# Altium schematic sheet SHDN-S05-V00-Microcontroller.SchDoc: Microcontroller
size A3; DrawnBy: Zoe Goodward; DocumentNumber: 2; Revision: 01; SheetNumber: 2; SheetTotal: 10; Version: 01; Project: Shutdown Board 2020; PageSetup: Record=PageOptions|CenterHorizontal=True|CenterVertical=True|PrintScale=0.97|XCorrection=1.00|YCorrection=1.00|PrintKind=0|BorderSize=5000000|LeftOffset=0|BottomOffset=0|Orientation=2|PaperLength=1000|PaperWidth=1000|Scale=100|PaperSource=7|PrintQuality=-4|MediaType=1|DitherType=10|PaperKind=A4|PrintScaleMode=1
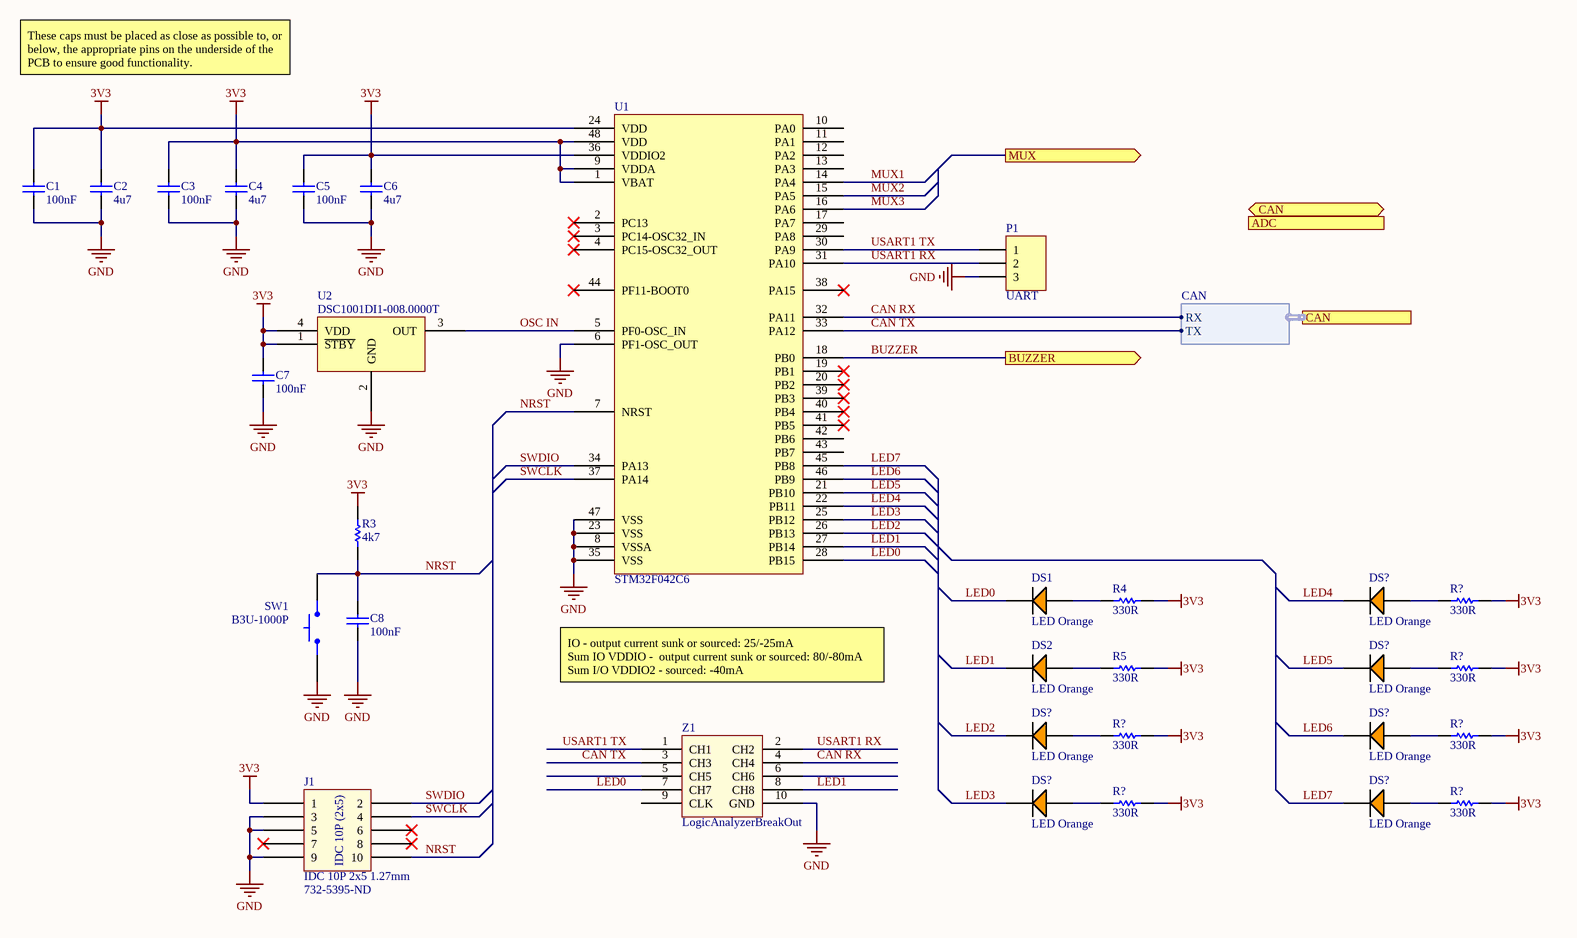
[diagram p0: SHDN-S05-V00-Microcontroller.SchDoc]

## Parts
(Parts that share a designator on the sheet are numbered #1, #2 ... from top to bottom, then left to right.)
C1  100nF  [Cap_Ceramic_0603]
C2  4u7  [Cap_Ceramic_0603]
C3  100nF  [Cap_Ceramic_0603]
C4  4u7  [Cap_Ceramic_0603]
C5  100nF  [Cap_Ceramic_0603]
C6  4u7  [Cap_Ceramic_0603]
C7  100nF  [Cap_Ceramic_0603]
C8  100nF  [Cap_Ceramic_0603]
DS1  LED Orange  [LED ORANGE 0603]
DS2  LED Orange  [LED ORANGE 0603]
DS?#1  LED Orange  [LED ORANGE 0603]
DS?#2  LED Orange  [LED ORANGE 0603]
DS?#3  LED Orange  [LED ORANGE 0603]
DS?#4  LED Orange  [LED ORANGE 0603]
DS?#5  LED Orange  [LED ORANGE 0603]
DS?#6  LED Orange  [LED ORANGE 0603]
J1  IDC 10P 2x5 1.27mm  [IDC 1.27MM 10P]
P1  UART  [HDR1X3]
R3  4k7  [Res_ThinFilm_0603]
R4  330R  [Res_ThinFilm_0603]
R5  330R  [Res_ThinFilm_0603]
R?#1  330R  [Res_ThinFilm_0603]
R?#2  330R  [Res_ThinFilm_0603]
R?#3  330R  [Res_ThinFilm_0603]
R?#4  330R  [Res_ThinFilm_0603]
R?#5  330R  [Res_ThinFilm_0603]
R?#6  330R  [Res_ThinFilm_0603]
SW1  B3U-1000P  [BTN B3U-1000P]
U1  STM32F042C6  [STM32F042C6]
U2  DSC1001DI1-008.0000T  [DSC1001DI1-008.0000TCT-ND]
Z1  LogicAnalyzerBreakOut  [LogicAnalyzer]

## Ports
ADC (in), BUZZER (out), CAN (bidir), CAN (harness CAN), MUX (out)

## Harnesses
CAN: RX, TX

## Nets
3V3: C1.2 C2.2 C3.2 C4.2 C5.2 C6.2 C7.2 J1.1 R3.2 R4.2 R5.2 R?#1.2 R?#2.2 R?#3.2 R?#4.2 R?#5.2 R?#6.2 U1.1(VBAT) U1.9(VDDA) U1.24(VDD) U1.36(VDDIO2) U1.48(VDD) U2.1(~{STBY}) U2.4(VDD)
GND: C1.1 C2.1 C3.1 C4.1 C5.1 C6.1 C7.1 C8.1 J1.3 J1.5 J1.9 P1.3 SW1.1 U1.6(PF1-OSC_OUT) U1.8(VSSA) U1.23(VSS) U1.35(VSS) U1.47(VSS) U2.2(GND) Z1.10(GND)
BUZZER: U1.18(PB0) ; port BUZZER
CAN RX: U1.32(PA11) Z1.4(CH4) ; port CAN.RX
CAN TX: U1.33(PA12) Z1.3(CH3) ; port CAN.TX
LED0: DS1.2(C) U1.28(PB15) Z1.7(CH7)
LED1: DS2.2(C) U1.27(PB14) Z1.8(CH8)
LED2: DS?#3.2(C) U1.26(PB13)
LED3: DS?#5.2(C) U1.25(PB12)
LED4: DS?#1.2(C) U1.22(PB11)
LED5: DS?#2.2(C) U1.21(PB10)
LED6: DS?#4.2(C) U1.46(PB9)
LED7: DS?#6.2(C) U1.45(PB8)
MUX1: U1.14(PA4)
MUX2: U1.15(PA5)
MUX3: U1.16(PA6)
NRST: C8.2 J1.10 R3.1 SW1.2 U1.7(NRST)
OSC IN: U1.5(PF0-OSC_IN) U2.3(OUT)
SWCLK: J1.4 U1.37(PA14)
SWDIO: J1.2 U1.34(PA13)
USART1 RX: P1.2 U1.31(PA10) Z1.2(CH2)
USART1 TX: P1.1 U1.30(PA9) Z1.1(CH1)
NetDS1_1: DS1.1(A) R4.1
NetDS2_1: DS2.1(A) R5.1
NetDS?#1_1: DS?#1.1(A) R?#1.1
NetDS?#2_1: DS?#2.1(A) R?#2.1
NetDS?#3_1: DS?#3.1(A) R?#3.1
NetDS?#4_1: DS?#4.1(A) R?#4.1
NetDS?#5_1: DS?#5.1(A) R?#5.1
NetDS?#6_1: DS?#6.1(A) R?#6.1

Not connected (* = marked no-connect by the designer): J1 6* 7* 8*; U1 2(PC13)* 3(PC14-OSC32_IN)* 4(PC15-OSC32_OUT)* 10(PA0) 11(PA1) 12(PA2) 13(PA3) 17(PA7) 19(PB1)* 20(PB2)* 29(PA8) 38(PA15)* 39(PB3)* 40(PB4)* 41(PB5)* 42(PB6) 43(PB7) 44(PF11-BOOT0)*; Z1 5(CH5) 6(CH6) 9(CLK)

## Notes on the sheet
- These caps must be placed as close as possible to, or below, the appropriate pins on the underside of the PCB to ensure good functionality.
- IO - output current sunk or sourced: 25/-25mA
  Sum IO VDDIO -  output current sunk or sourced: 80/-80mA
  Sum I/O VDDIO2 - sourced: -40mA
- (near J1) 732-5395-ND
- Revision History:
- Sheet Title:
- Rev
- Date
- Description
- Project:
- Size:
- Drawn By:
- A3
- Number:
- Revision:
- Sheet
- Version:
- of
- QUT Motorsport
- O-120, Gardens Point
- 2 George Street
- Brisbane, QLD 4000
- Australia
- Print Date:
- Print Time:
- File Name:
- (in symbol IDC 10P 2x5 1.27mm) IDC 10P (2x5)

## Library data of the parts
C1 C3 C5 C7 C8 = 100nF 50V 5% X7R 0603: Capacitor, Ceramic, SMD, 100nF, 50V, 5%, X7R, 0603
C2 C4 C6 = 4u7 50V 5% X7R 0603: Capacitor, Ceramic, SMD, 4u7, 50V, 5%, X7R, 0603
DS1 DS2 DS?#1-DS?#6 = LED ORANGE 0603
P1 = Header 3: Header, 3-Pin; LatestRevisionDate: 17-Jul-2002; LatestRevisionNote: Re-released for DXP Platform.; Publisher: Altium Limited
R3 = 4k7 5% 0603: Resistor, SMD, 4k7, 0.1W, 5%, 0603
R4 R5 R?#1-R?#6 = 330R 5% 0603: Resistor, SMD, 330R, 0.1W, 5%, 0603
SW1 = BTN B3U-1000P: Omron B3U-1000P Ultra Miniture Switch; ComponentLink1Description: LCSC; ComponentLink1URL: https://lcsc.com/product-detail/Tactile-Switches_BRIGHT-TSA063G50-250_C294565.html
U1 = STM32042C6: ARM® Cortex®-M0 STM32F0 Microcontroller IC 32-Bit 48MHz 32KB (32K x 8) FLASH 48-LQFP (7x7); ComponentLink1Description: Digikey; ComponentLink1URL: https://www.digikey.com.au/product-detail/en/stmicroelectronics/STM32F042C6T6TR/497-19319-1-ND/10063344; ComponentLink2Description: Datasheet; ComponentLink2URL: https://www.st.com/resource/en/datasheet/stm32f042k6.pdf
U2 = DSC1001DI1-008.0000T: on 8MHz XO (Standard) CMOS Oscillator 1.8 ~ 3.3V Standby (Power Down) 4-SMD, No Lead
Z1 = LogicAnalyer